# Altium schematic sheet ALU_Shift.SchDoc
size B; Author: E. Sims; Organization: Let's Build Rockets Inc.; SheetNumber: 2; SheetTotal: 3
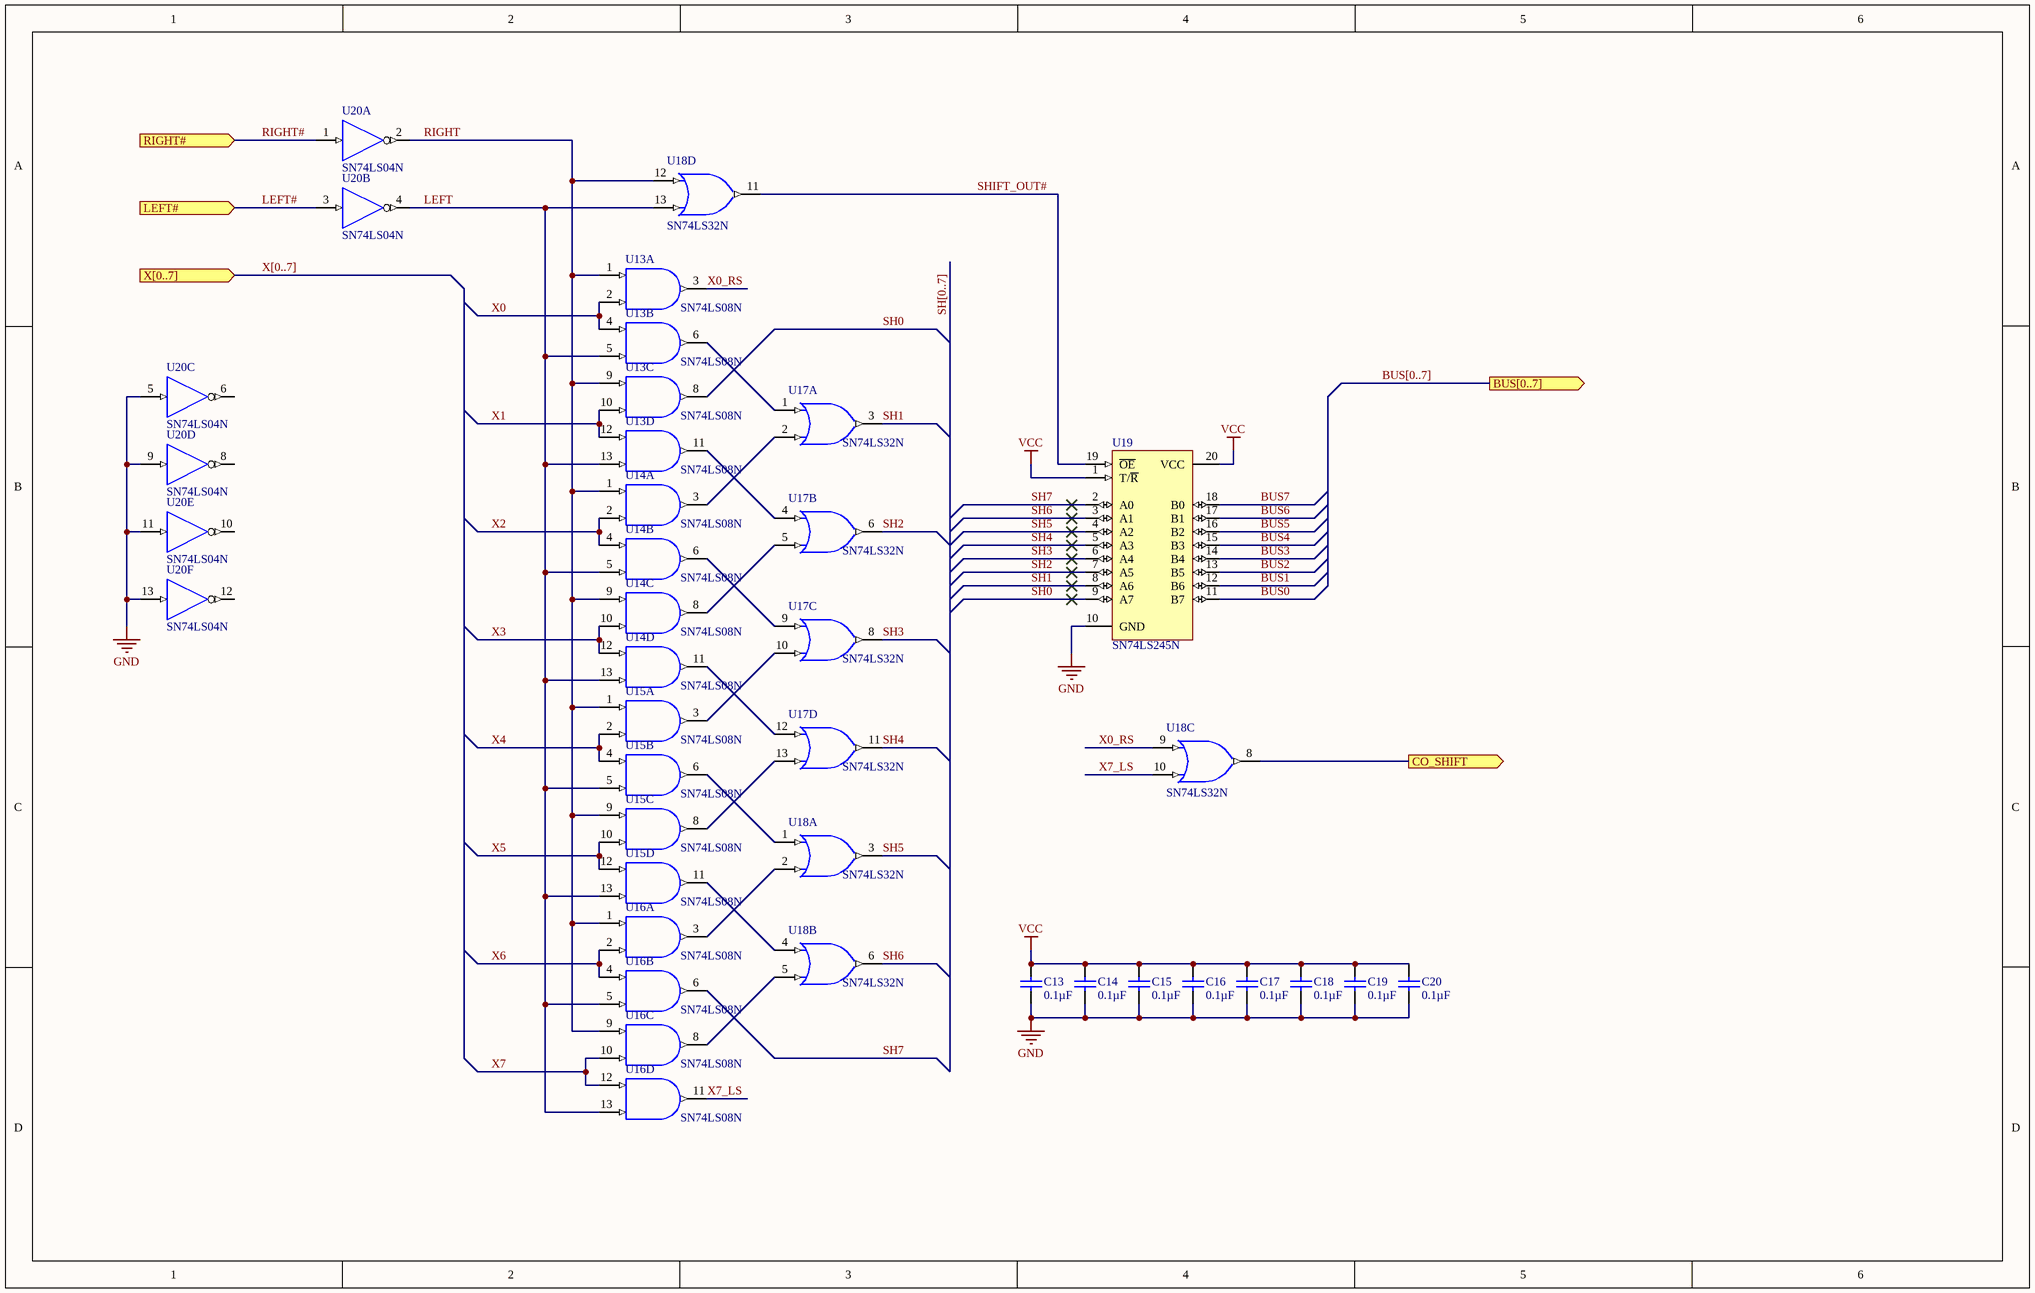
[diagram p0: ALU_Shift.SchDoc]

## Parts
C13  Capacitance: 0.1µF  [VISH-K104K15X7RF5TL2]  (hidden comment: K104K15X7RF5TL2)
C14  Capacitance: 0.1µF  [VISH-K104K15X7RF5TL2]  (hidden comment: K104K15X7RF5TL2)
C15  Capacitance: 0.1µF  [VISH-K104K15X7RF5TL2]  (hidden comment: K104K15X7RF5TL2)
C16  Capacitance: 0.1µF  [VISH-K104K15X7RF5TL2]  (hidden comment: K104K15X7RF5TL2)
C17  Capacitance: 0.1µF  [VISH-K104K15X7RF5TL2]  (hidden comment: K104K15X7RF5TL2)
C18  Capacitance: 0.1µF  [VISH-K104K15X7RF5TL2]  (hidden comment: K104K15X7RF5TL2)
C19  Capacitance: 0.1µF  [VISH-K104K15X7RF5TL2]  (hidden comment: K104K15X7RF5TL2)
C20  Capacitance: 0.1µF  [VISH-K104K15X7RF5TL2]  (hidden comment: K104K15X7RF5TL2)
U13  SN74LS08N  [N014]  (parts A,B,C,D of 4)
U14  SN74LS08N  [N014]  (parts A,B,C,D of 4)
U15  SN74LS08N  [N014]  (parts A,B,C,D of 4)
U16  SN74LS08N  [N014]  (parts A,B,C,D of 4)
U17  SN74LS32N  [N014]  (parts A,B,C,D of 4)
U18  SN74LS32N  [N014]  (parts A,B,C,D of 4)
U19  SN74LS245N  [N020]
U20  SN74LS04N  [N014]  (parts A,B,C,D,E,F of 6)

## Ports
BUS[0..7] (out), CO_SHIFT (out), LEFT# (in), RIGHT# (in), X[0..7] (in)

## Nets
GND: C13.2 C14.2 C15.2 C16.2 C17.2 C18.2 C19.2 C20.2 U13.7(GND) U14.7(GND) U15.7(GND) U16.7(GND) U17.7(GND) U18.7(GND) U19.10(GND) U20.5(A) U20.7(GND) U20.9(A) U20.11(A) U20.13(A)
VCC: C13.1 C14.1 C15.1 C16.1 C17.1 C18.1 C19.1 C20.1 U13.14(VCC) U14.14(VCC) U15.14(VCC) U16.14(VCC) U17.14(VCC) U18.14(VCC) U19.1(T/~{R}) U19.20(VCC) U20.14(VCC)
BUS0: U19.11(B7)
BUS1: U19.12(B6)
BUS2: U19.13(B5)
BUS3: U19.14(B4)
BUS4: U19.15(B3)
BUS5: U19.16(B2)
BUS6: U19.17(B1)
BUS7: U19.18(B0)
CO_SHIFT: U18.8(Y) ; port CO_SHIFT
LEFT: U13.5(B) U13.13(B) U14.5(B) U14.13(B) U15.5(B) U15.13(B) U16.5(B) U16.13(B) U18.13(B) U20.4(Y)
LEFT#: U20.3(A) ; port LEFT#
RIGHT: U13.1(A) U13.9(A) U14.1(A) U14.9(A) U15.1(A) U15.9(A) U16.1(A) U16.9(A) U18.12(A) U20.2(Y)
RIGHT#: U20.1(A) ; port RIGHT#
SH0: U13.8(Y) U19.9(A7)
SH1: U17.3(Y) U19.8(A6)
SH2: U17.6(Y) U19.7(A5)
SH3: U17.8(Y) U19.6(A4)
SH4: U17.11(Y) U19.5(A3)
SH5: U18.3(Y) U19.4(A2)
SH6: U18.6(Y) U19.3(A1)
SH7: U16.6(Y) U19.2(A0)
SHIFT_OUT#: U18.11(Y) U19.19(~{OE})
X0: U13.2(B) U13.4(A)
X0_RS: U13.3(Y) U18.9(A)
X1: U13.10(B) U13.12(A)
X2: U14.2(B) U14.4(A)
X3: U14.10(B) U14.12(A)
X4: U15.2(B) U15.4(A)
X5: U15.10(B) U15.12(A)
X6: U16.2(B) U16.4(A)
X7: U16.10(B) U16.12(A)
X7_LS: U16.11(Y) U18.10(B)
NetU13_6: U13.6(Y) U17.1(A)
NetU13_11: U13.11(Y) U17.4(A)
NetU14_3: U14.3(Y) U17.2(B)
NetU14_6: U14.6(Y) U17.9(A)
NetU14_8: U14.8(Y) U17.5(B)
NetU14_11: U14.11(Y) U17.12(A)
NetU15_3: U15.3(Y) U17.10(B)
NetU15_6: U15.6(Y) U18.1(A)
NetU15_8: U15.8(Y) U17.13(B)
NetU15_11: U15.11(Y) U18.4(A)
NetU16_3: U16.3(Y) U18.2(B)
NetU16_8: U16.8(Y) U18.5(B)

Not connected (* = marked no-connect by the designer): U20 6(Y) 8(Y) 10(Y) 12(Y)

## Buses and harness runs
bus BUS[0..7] = port BUS[0..7]
bus SH[0..7]
bus X[0..7] = port X[0..7]

## Notes on the sheet
- Let's Build Rocket's Inc. Modular Paylaod System Based on TMP-010 Rev
  For more information visit https://github.com/LetsBuildRockets/Modular-Payload-System
  This work is licensed under CC BY-NC 4.0. To view a copy of this license, visit https://creativecommons.org/licenses/by-nc/4.0
- Title
- Size:
- Date:
- Assembly Variant:
- B
- Number:
- Time:
- Revision:
- Sheet
- of
- Author:
- File:

## Library data of the parts
C13-C20 = CMP-2000-06508-1: Ceramic Capacitor, 100 nF, +/- 10%, 50 V, -55 to 125 degC, 2-Pin THD, RoHS, Tape and Reel; Manufacturer: Vishay; Other Names: BC1084CT; Catalog Drawings: Mono-KapSide2-15_5.58Mono-KapSide1_15; Temperature Coefficient: X7R; Voltage - Rated: 50V; Online Catalog: Mono-Kap™Series; Size / Dimension: 0.157"Lx0.098"W(4.00mmx2.50mm); Operating Temperature: -55°C~125°C; Family: CeramicCapacitors; Manufacturer URL: http://www.vishay.com/; Standard Package: 1; Thickness (Max): -; Ratings: -; Datasheet Version: 08/2013; Package Description: 2-Pin Through Hole Device, Body 4 x 2.6 mm; Mounting Type: ThroughHole; Features: -; Lead Spacing: 0.098"(2.50mm); Tolerance: ±10%; Category: Capacitors; Mounting Technology: ThroughHole; Lead Style: Straight; Datasheet URL: http://www.vishay.com/docs/45171/kseries.pdf; Applications: GeneralPurpose; Package / Case: Radial; Height - Seated (Max): 0.220"(5.58mm); Package Reference: K104K15X7RF5TL2; Series: Mono-Kap™K; Packaging: CutTape(CT)
U13-U16 = SN74LS08N: Quadruple 2-Input Positive-AND Gate; Published: 8-Jun-2000; LatestRevisionDate: 04-Mar-2005; LatestRevisionNote: Stylized 3D Model Added.; DatasheetVersion: Mar-1988; PackageVersion: Oct-1995; PackageReference: N014; Publisher: Altium Limited; PackageDescription: DIP; 14 Leads; Row Spacing 7.62 mm; Pitch 2.54 mm; ComponentLink1Description: Manufacturer Link; ComponentLink1URL: http://www.ti.com/; ComponentLink2Description: Datasheet; ComponentLink2URL: http://www-s.ti.com/sc/ds/SN74LS08.pdf
U17 U18 = SN74LS32N: Quadruple 2-Input Positive-OR Gate; Published: 8-Jun-2000; LatestRevisionDate: 04-Mar-2005; LatestRevisionNote: Stylized 3D Model Added.; DatasheetVersion: Mar-1988; PackageVersion: Oct-1995; PackageReference: N014; Publisher: Altium Limited; PackageDescription: DIP; 14 Leads; Row Spacing 7.62 mm; Pitch 2.54 mm; ComponentLink1Description: Manufacturer Link; ComponentLink1URL: http://www.ti.com/; ComponentLink2Description: Datasheet; ComponentLink2URL: http://www-s.ti.com/sc/ds/sn74ls32.pdf
U19 = SN74LS245N: Octal Bus Transceiver with 3-State Outputs; Published: 8-Jun-2000; LatestRevisionDate: 04-Mar-2005; LatestRevisionNote: Stylized 3D Model Added.; DatasheetVersion: Mar-1988; PackageVersion: Oct-1995; PackageReference: N020; Publisher: Altium Limited; PackageDescription: DIP; 20 Leads; Row Spacing 7.62 mm; Pitch 2.54 mm; ComponentLink1Description: Manufacturer Link; ComponentLink1URL: http://www.ti.com/; ComponentLink2Description: Datasheet; ComponentLink2URL: http://www-s.ti.com/sc/ds/sn74ls245.pdf
U20 = SN74LS04N: Hex Inverter; Published: 8-Jun-2000; LatestRevisionDate: 04-Mar-2005; LatestRevisionNote: Stylized 3D Model Added.; DatasheetVersion: Mar-1988; PackageVersion: Oct-1995; PackageReference: N014; Publisher: Altium Limited; PackageDescription: DIP; 14 Leads; Row Spacing 7.62 mm; Pitch 2.54 mm; ComponentLink1Description: Manufacturer Link; ComponentLink1URL: http://www.ti.com/; ComponentLink2Description: Datasheet; ComponentLink2URL: http://www-s.ti.com/sc/ds/sn74ls04.pdf